# Altium schematic sheet 13-MECHANICALS.SchDoc: MECHANICALS
size A4; Author: Alexandre Cosneau; CompanyName: Tristar Multicopters; DrawnBy: Alexandre Cosneau; Engineer: Alexandre Cosneau; Organization: Tristar Multicopters; Address1: Genie / GEGI; Address2: 2500 boulevard de l'universite; Address3: J1K2R SHERBROOKE; Address4: QUEBEC, CANADA; DocumentNumber: 7; Revision: 1.0; SheetNumber: 7; SheetTotal: 7
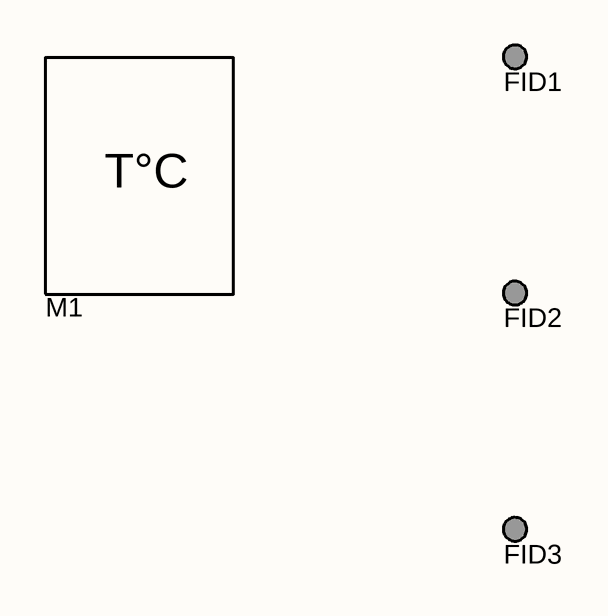
[diagram p0: 13-MECHANICALS.SchDoc]

## Parts
FID1  Fiducial  [FID_05MM]  (value not drawn)  (net tie, no BOM)
FID2  Fiducial  [FID_05MM]  (value not drawn)  (net tie, no BOM)
FID3  Fiducial  [FID_05MM]  (value not drawn)  (net tie, no BOM)
M1  THERMAL PAD  (value not drawn)  (net tie, no BOM)

## Notes on the sheet
- Title:
- Size:
- Date:
- A
- Revision:
- Time:
- Author:
- Sheet
- of
- File:
- (in symbol THERMAL PAD) T°C

## Library data of the parts
FID1-FID3 = FID_05MM: FIDUCIAL 05 MM; Value: Top; Package: Fiducial; Published: 07.04.2019; Mount Type: SMT; Publisher: Hefest; Technology: Pcb; TYPE: Fiducial
M1 = THERMAL PAD: THERMAL PAD NEEDED